# EAGLE schematic BusPirate-ultra-testboard.v1.0 (EAGLE 9.1.3)
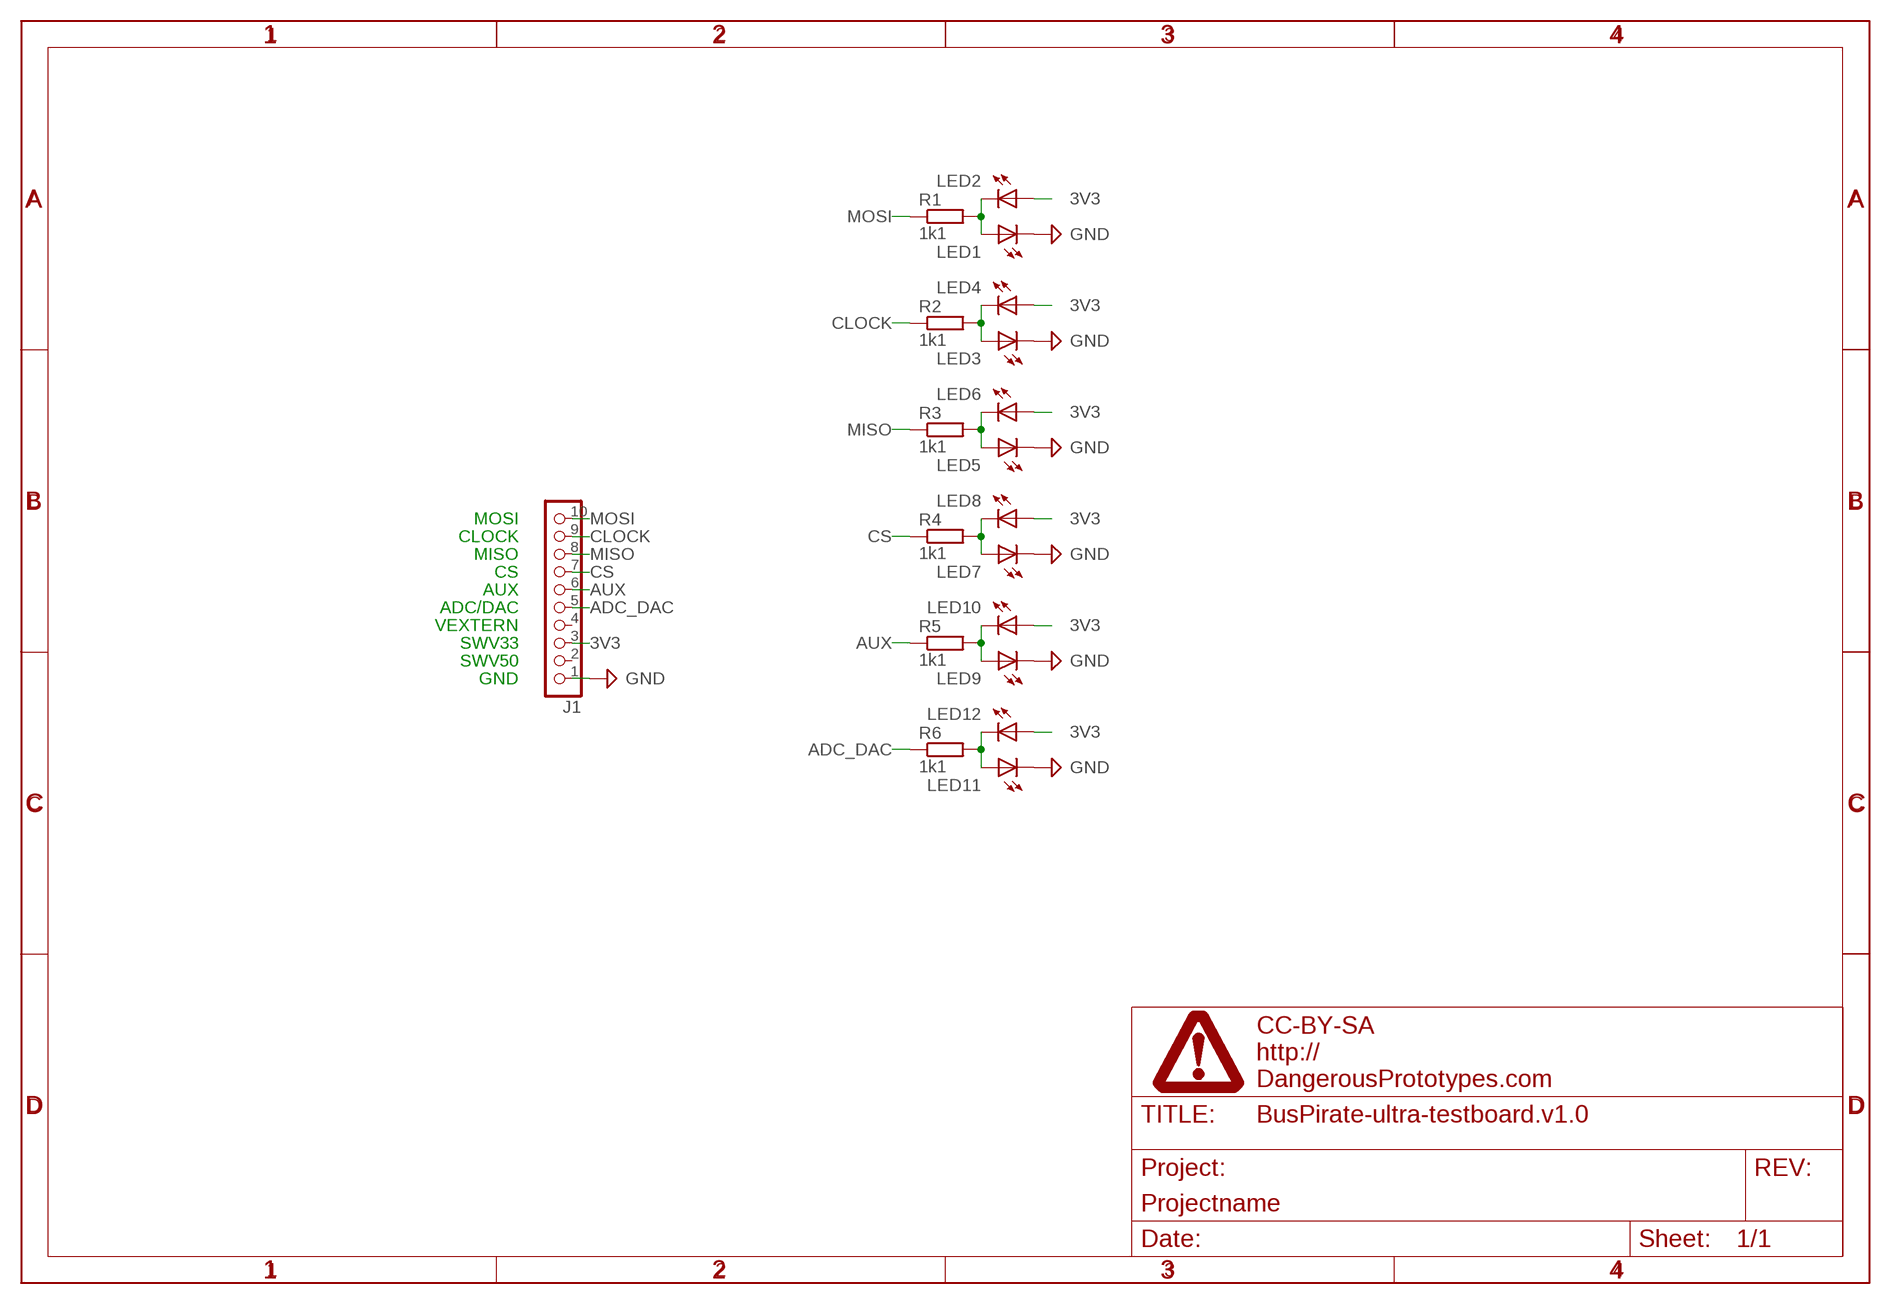
[diagram p0: schematic, sheet 1]

## Parts
J1  CON_HEADER_1X10-RIGHT_ANGLED_PTH  [M1X10_FEMALE_RIGHT_ANGLED_PTH]
LED1  LED-0805  [LED-805]
LED2  LED-0805  [LED-805]
LED3  LED-0805  [LED-805]
LED4  LED-0805  [LED-805]
LED5  LED-0805  [LED-805]
LED6  LED-0805  [LED-805]
LED7  LED-0805  [LED-805]
LED8  LED-0805  [LED-805]
LED9  LED-0805  [LED-805]
LED10  LED-0805  [LED-805]
LED11  LED-0805  [LED-805]
LED12  LED-0805  [LED-805]
PAGE1  FRAME_DINA4_L  [DP_LOGO]
R1  1k1  RESISTOR-0603  [R603]
R2  1k1  RESISTOR-0603  [R603]
R3  1k1  RESISTOR-0603  [R603]
R4  1k1  RESISTOR-0603  [R603]
R5  1k1  RESISTOR-0603  [R603]
R6  1k1  RESISTOR-0603  [R603]

## Nets
3V3: J1.3 LED2.A LED4.A LED6.A LED8.A LED10.A LED12.A
ADC_DAC: J1.5 R6.1
AUX: J1.6 R5.1
CLOCK: J1.9 R2.1
CS: J1.7 R4.1
GND: J1.1 LED1.C LED3.C LED5.C LED7.C LED9.C LED11.C ; supply symbol labelled DGND
MISO: J1.8 R3.1
MOSI: J1.10 R1.1
N$1: LED1.A LED2.C R1.2
N$2: LED3.A LED4.C R2.2
N$3: LED5.A LED6.C R3.2
N$4: LED7.A LED8.C R4.2
N$5: LED9.A LED10.C R5.2
N$6: LED11.A LED12.C R6.2
Unconnected: J1.2 J1.4

## Notes on the sheet
- MOSI
- CLOCK
- MISO
- CS
- AUX
- ADC/DAC
- VEXTERN
- SWV33
- SWV50
- GND

## Library data of the parts
J1 = dp_devices.v6:CON_HEADER_1X10
LED1-LED12 = dp_devices.v6:LED: Light Emitting Diode
PAGE1 = dp_devices.v6:FRAME_DINA4_L: A4 DP frame Standard Dangerous Prototypes schematic frame. Automagically adds the DP logo and standard texts to the PCB Use the atrribute in the schematic editor to change the fields.; FF1: fulfillment by; FF2: Seeed Studio; FF3: www.seeedstudio.com; LICENSE: CC-BY-SA; PROJECT: Projectname; URL1: http://; URL2: DangerousPrototypes.com
R1-R6 = dp_devices.v6:RESISTOR